# Altium project ESP32_Flag_Tracker.PrjPcb
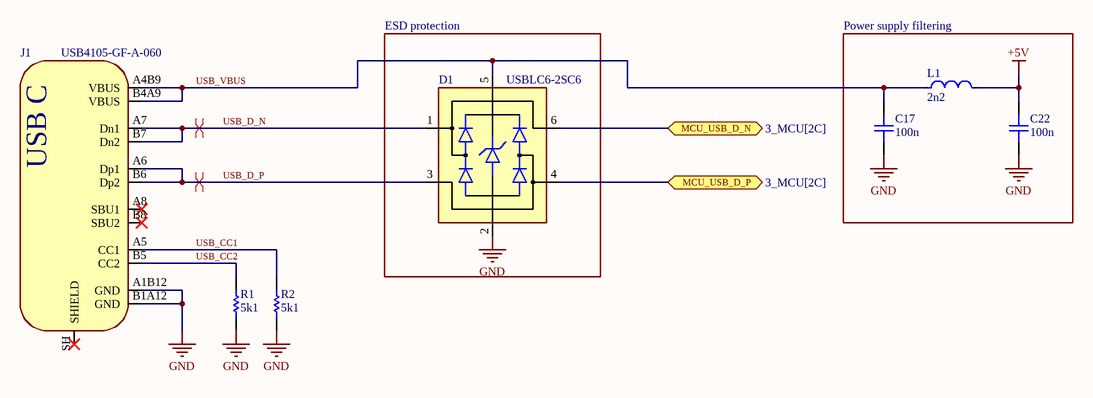
[diagram p0: 1_USB.SchDoc]
6 sheets, 53 parts. Net scope: flat (ports and power ports of the same name join across sheets).
Board file: PCB.PcbDoc
Sheets:
  0_Overview.SchDoc
  1_USB.SchDoc
  2_Power.SchDoc
  3_MCU.SchDoc
  4_Accelerometer.SchDoc
  5_RF.SchDoc

## Sheet 0_Overview.SchDoc
size A4; SheetNumber: 3; SheetTotal: 3

## Sheet 1_USB.SchDoc
size A4; SheetNumber: 2; SheetTotal: 6

### Parts
C17  100n  [CAP_0402]
C22  100n  [CAP_0402]
D1  USBLC6-2SC6  [SOT-23-6]
J1  USB4105-GF-A-060  [USB4105-GF-A-060]
L1  2n2  [FP-LQW15AN_80-MFG]
R1  5k1  [RESC1005X40X25ML10T10]
R2  5k1  [RESC1005X40X25ML10T10]

### Blocks framed on the sheet
ESD protection: D1
Power supply filtering: C17 C22 L1

### Ports
MCU_USB_D_N (bidir, see 3_MCU[2C]), MCU_USB_D_P (bidir, see 3_MCU[2C])

### Nets
+5V: C22.2 L1.2
GND: C17.1 C22.1 D1.2(GND) J1.A1B12(GND) J1.B1A12(GND) R1.2 R2.2
MCU_USB_D_N: D1.6(IO1) ; port MCU_USB_D_N
MCU_USB_D_P: D1.4(IO2) ; port MCU_USB_D_P
USB_CC1: J1.A5(CC1) R2.1
USB_CC2: J1.B5(CC2) R1.1
USB_D_N: D1.1(IO1) J1.A7(Dn1) J1.B7(Dn2)
USB_D_P: D1.3(IO2) J1.A6(Dp1) J1.B6(Dp2)
USB_VBUS: C17.2 D1.5(VBUS) J1.A4B9(VBUS) J1.B4A9(VBUS) L1.1

Not connected (* = marked no-connect by the designer): J1 A8(SBU1)* B8(SBU2)* SH(SHIELD)*

### Layout directives
differential pair: USB_D_N, USB_D_P

### Notes on the sheet
- (in symbol USB4105-GF-A-060) USB C

### Library data of the parts
C17 C22 = CAP_0402_16V: Capacitor SMD 0402 16V; Supplier 1: Mouser; Supplier Part Number 1: 187-CL05A104KP5NNND
D1 = USBLC6-2SC6: Low-Capacitance ESD Protection USB; Manufacturer: STMicroelectronics; Manufacturer Part Number: USBLC6-2SC6; Distributor Link: https://www.mouser.de/ProductDetail/STMicroelectronics/USBLC6-2SC6?qs=po45yt2pPpu%2FhNIlwQdTlg%3D%3D; Supplier 1: Mouser; Supplier Part Number 1: 511-USBLC6-2SC6
J1 = USB4105-GF-A-060: USB Connector Type C SMT 12 Pin; Manufacturer: GCT; Manufacturer Part Number: USB4105-GF-A-060
L1 = CMP-06042-014713-1: Wire Wound RF Inductor 2.2nH ±2% 2530mA 0.022Ω 0402 (1005)
R1 R2 = CMP-2002-03675-1: Part Number: RK73B1ETTP512J; Manufacturer: KOA Speer

## Sheet 2_Power.SchDoc
size A4; SheetNumber: 3; SheetTotal: 7
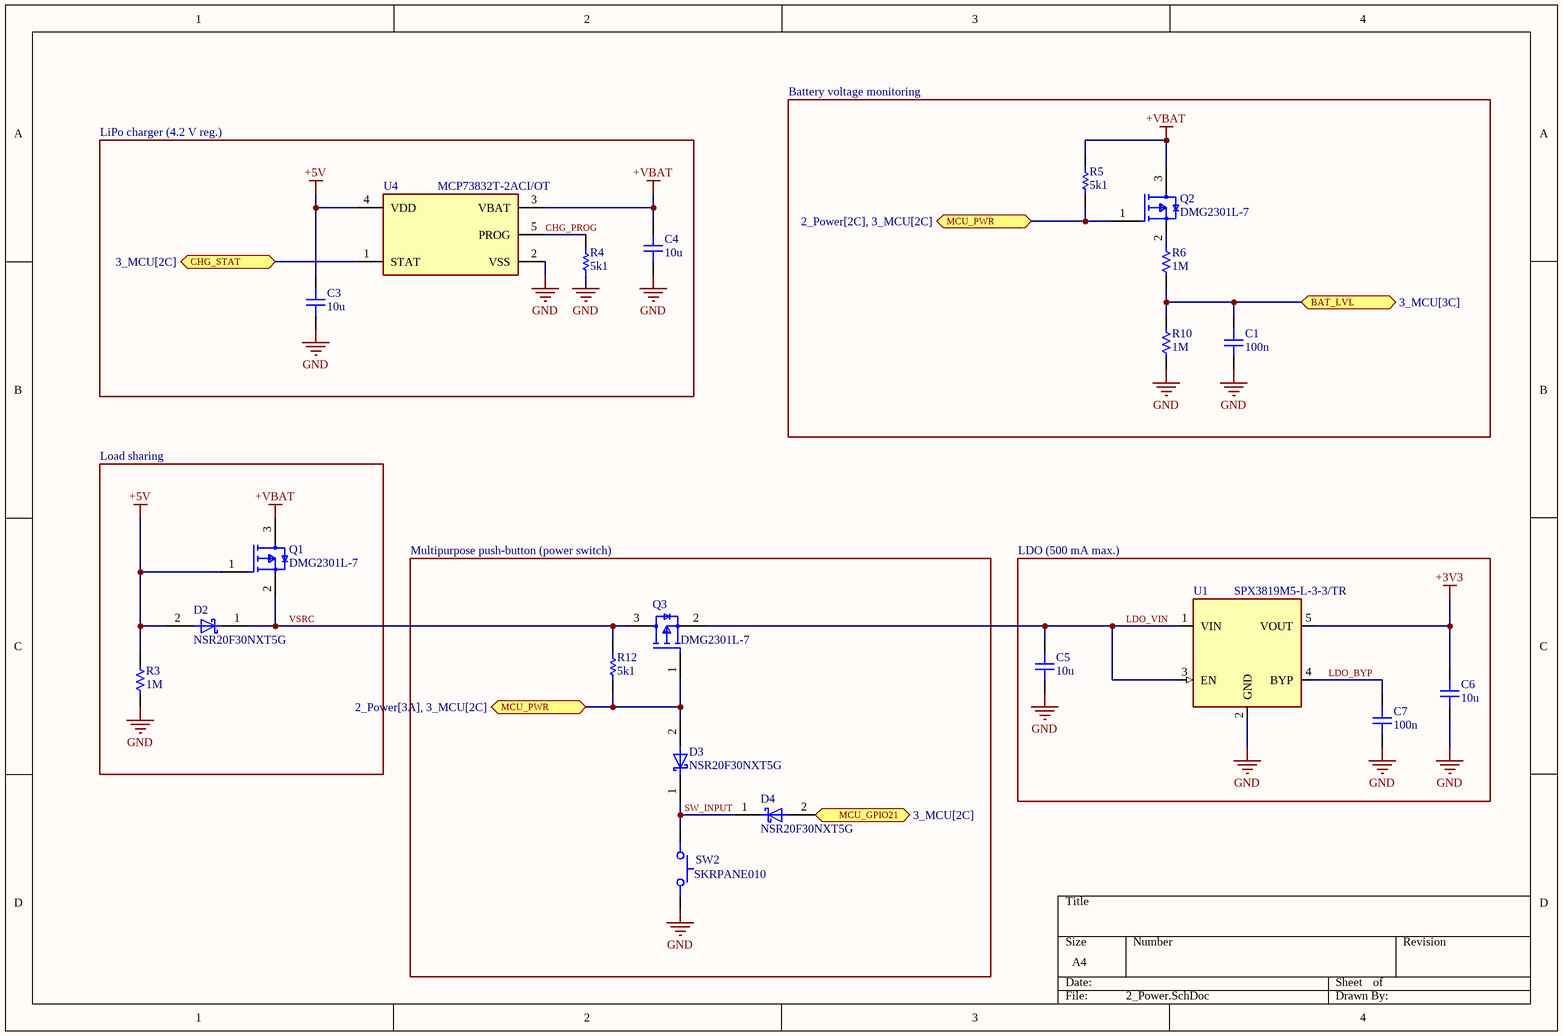
[diagram p1: 2_Power.SchDoc]

### Parts
C1  100n  [CAP_0402]
C3  10u  [CAP_0402]
C4  10u  [CAP_0402]
C5  10u  [CAP_0402]
C6  10u  [CAP_0402]
C7  100n  [CAP_0402]
D2  NSR20F30NXT5G  [ONSC-DSN-2-512AB-01_V]
D3  NSR20F30NXT5G  [ONSC-DSN-2-512AB-01_V]
D4  NSR20F30NXT5G  [ONSC-DSN-2-512AB-01_V]
Q1  DMG2301L-7  [FP-SOT23-MFG]
Q2  DMG2301L-7  [FP-SOT23-MFG]
Q3  DMG2301L-7  [FP-SOT23-MFG]
R3  1M  [RES_0402]
R4  5k1  [RESC1005X40X25ML10T10]
R5  5k1  [RESC1005X40X25ML10T10]
R6  1M  [RES_0402]
R10  1M  [RES_0402]
R12  5k1  [RESC1005X40X25ML10T10]
SW2  SKRPANE010  [SKRPANE010]
U1  SPX3819M5-L-3-3/TR  [SOT-23-5]
U4  MCP73832T-2ACI/OT  [FP-C04-091-OT-MFG]

### Blocks framed on the sheet
Battery voltage monitoring: C1 Q2 R5 R6 R10
LiPo charger (4.2 V reg.): C3 C4 R4 U4
Load sharing: D2 Q1 R3
Multipurpose push-button (power switch): D3 D4 Q3 R12 SW2
LDO (500 mA max.): C5-C7 U1

### Ports
BAT_LVL (bidir, see 3_MCU[3C]), CHG_STAT (bidir, see 3_MCU[2C]), MCU_GPIO21 (bidir, see 3_MCU[2C]), MCU_PWR (bidir, see 2_Power[2C], 3_MCU[2C]), MCU_PWR (bidir, see 2_Power[3A], 3_MCU[2C])

### Nets
+3V3: C6.2 U1.5(VOUT)
+5V: C3.2 D2.2(A) Q1.1(G) R3.2 U4.4(VDD)
+VBAT: C4.2 Q1.3(D) Q2.3(D) R5.2 U4.3(VBAT)
GND: C1.1 C3.1 C4.1 C5.1 C6.1 C7.1 R3.1 R4.1 R10.1 SW2.12 U1.2(GND) U4.2(VSS)
CHG_PROG: R4.2 U4.5(PROG)
LDO_BYP: C7.2 U1.4(BYP)
LDO_VIN: C5.2 Q3.2(S) U1.1(VIN) U1.3(EN)
MCU_ADC1_CH0: C1.2 R6.1 R10.2 ; port BAT_LVL
MCU_GPIO6: U4.1(STAT) ; port CHG_STAT
MCU_GPIO20: D3.2(A) Q2.1(G) Q3.1(G) R5.1 R12.1 ; port MCU_PWR
MCU_GPIO21: D4.2(A) ; port MCU_GPIO21
SW_INPUT: D3.1(K) D4.1(K) SW2.34
VSRC: D2.1(K) Q1.2(S) Q3.3(D) R12.2
NetQ2_2: Q2.2(S) R6.2

### Library data of the parts
C1 C7 = CAP_0402_16V: Capacitor SMD 0402 16V; Supplier 1: Mouser; Supplier Part Number 1: 187-CL05A104KP5NNND
C3-C6 = CAP_0402_10V: Capacitor SMD 0402 10V; Supplier 1: Arrow Electronics; Supplier Part Number 1: GRM155R61A106ME11D
D2-D4 = ONSC_D_SCHOTTKY_0603-4: Rectifier Diode, Schottky, 1 Phase, 1 Element, 2A, 30V V(RRM), Silicon; Forward Voltage: 420mV; Qualification Status: Not Qualified; Number of Elements: 1; Application(s): EFFICIENCY; Non-rep Pk Forward Current-Max: 28A; Max Power Dissipation: 1.56W; Case Connection: ANODE; Reach SVHC Compliant: Yes; Diode Element Material: SILICON; Pins: 2; RoHS Compliant: Yes; Rep Pk Reverse Voltage-Max: 30V; Technology: SCHOTTKY; Terminal Position: BOTTOM; Surface Mount: Yes; Max Operating Temperature: 150°C; Package Shape: Rectangular; Diode Type: RECTIFIER; Number of Phases: 1; Terminal Form: No Lead; Max Output current: 2A; Package Style: CHIP CARRIERMeter
Q1-Q3 = CMP-12801-000065-1: MOSFET P-CH 20V 3A SOT23; Manufacturer: Diodes Inc.; Number Of Channels: 1; Turn On Delay Time: 5ns; Drain To Source Resistance: 120mΩ; Max Junction Temp: +150°C; Gate To Source Voltage: 8V; Power Dissipation: 1.5W; Rthja Max: 83°C/W; Max Forward Diode Voltage: -1.2V; Standoff Height: 0.013mm; Threshold Vgs Min: -0.4V; Input Capacitace At Vds: 476pF @ -10V; Depletion Mode: False; Gate Charge At Vgs: 5.5nC @ -4.5V; Pulse Drain Current: -10A; Drain To Source Voltage: -20V; Continuous Drain Current: -3A; Turn Off Delay Time: 30ns; Lead Free: Yes; Package: SOT23; ComponentLink2Description: Datasheet; Device Class L3: MOSFETs; Device Class L1: Discrete Semiconductors; Manufacturer Part Number: DMG2301L-7; Automotive: No; Height: 1.1mm; Category: Trans; Temperature Range High: +150°C; Digikey Description: MOSFET P-CH 20V 3A SOT23; RoHS: TRUE; Number Of P Channels: 1; Footprint Url: https://www.diodes.com/assets/Package-Files/SOT23.pdf; Octopart: https://octopart.com/dmg2301l-7-diodes+inc.-67250456; ComponentLink2URL: https://www.diodes.com/assets/Datasheets/DMG2301L.pdf; Mouser Description: Single P-Channel 20 V 1.5 W 5.5 nC Silicon Surface Mount Mosfet - SOT-23; Drain To Source Breakdown Voltage: -20V; Threshold Vgs Max: -1.2V; Device Class L2: Transistors; Temperature: -55°C to +150°C; Temperature Range Low: -55°C
R3 R6 R10 = RES_0402: Resistor SMD 0402; Manufacturer: *; Manufacturer Part Number: *; Distributor Link: *; Supplier 1: Mouser; Supplier Part Number 1: 71-CRCW04021M00FKEDC
R4 R5 R12 = CMP-2002-03675-1: as R1 on sheet 1_USB
SW2 = SKRPANE010: Tactile Switch SMD SPST; Manufacturer: Alps Alpine; Manufacturer Part Number: SKRPANE010; Supplier 1: Mouser; Supplier Part Number 1: 688-SKRPANE010
U1 = SPX3819M5-L-3-3/TR: 500mA +3.3V Low-Noise LDO Voltage Regulator; Manufacturer: MaxLinear; Manufacturer Part Number: SPX3819M5-L-3-3/TR
U4 = CMP-0133-00138-2: IC LI-ION/LI-POLY CTRLR SOT23-5; Output Current: 10mA; Output Voltage: 4.2V; Max Output Current: 500mA; Max Power Dissipation: 1.54W; Min Output Voltage: 4.168V; Number of Channels: 1; Max Supply Voltage: 6V; Min Supply Voltage: 3.75V; Max Output Voltage: 4.5V; Case/Package: SOT-23; Lead Free: Lead Free; Termination: SMD/SMT; Min Operating Temperature: -40°C; Max Operating Temperature: 85°C; Height: 1.3mm; Length: 3.1mm; Mount: Surface Mount; Package Quantity: 3000; Number of Pins: 5; Packaging: Tape and Reel; REACH SVHC: No SVHC; Contact Plating: Tin; Width: 1.8mm; Number of Cells: 1; Number of Outputs: 1; Power Dissipation: 1.54W; Max Charge Current: 500mA; Max Input Voltage: 6V; Radiation Hardening: No

## Sheet 3_MCU.SchDoc
size A4; SheetNumber: 4; SheetTotal: 6
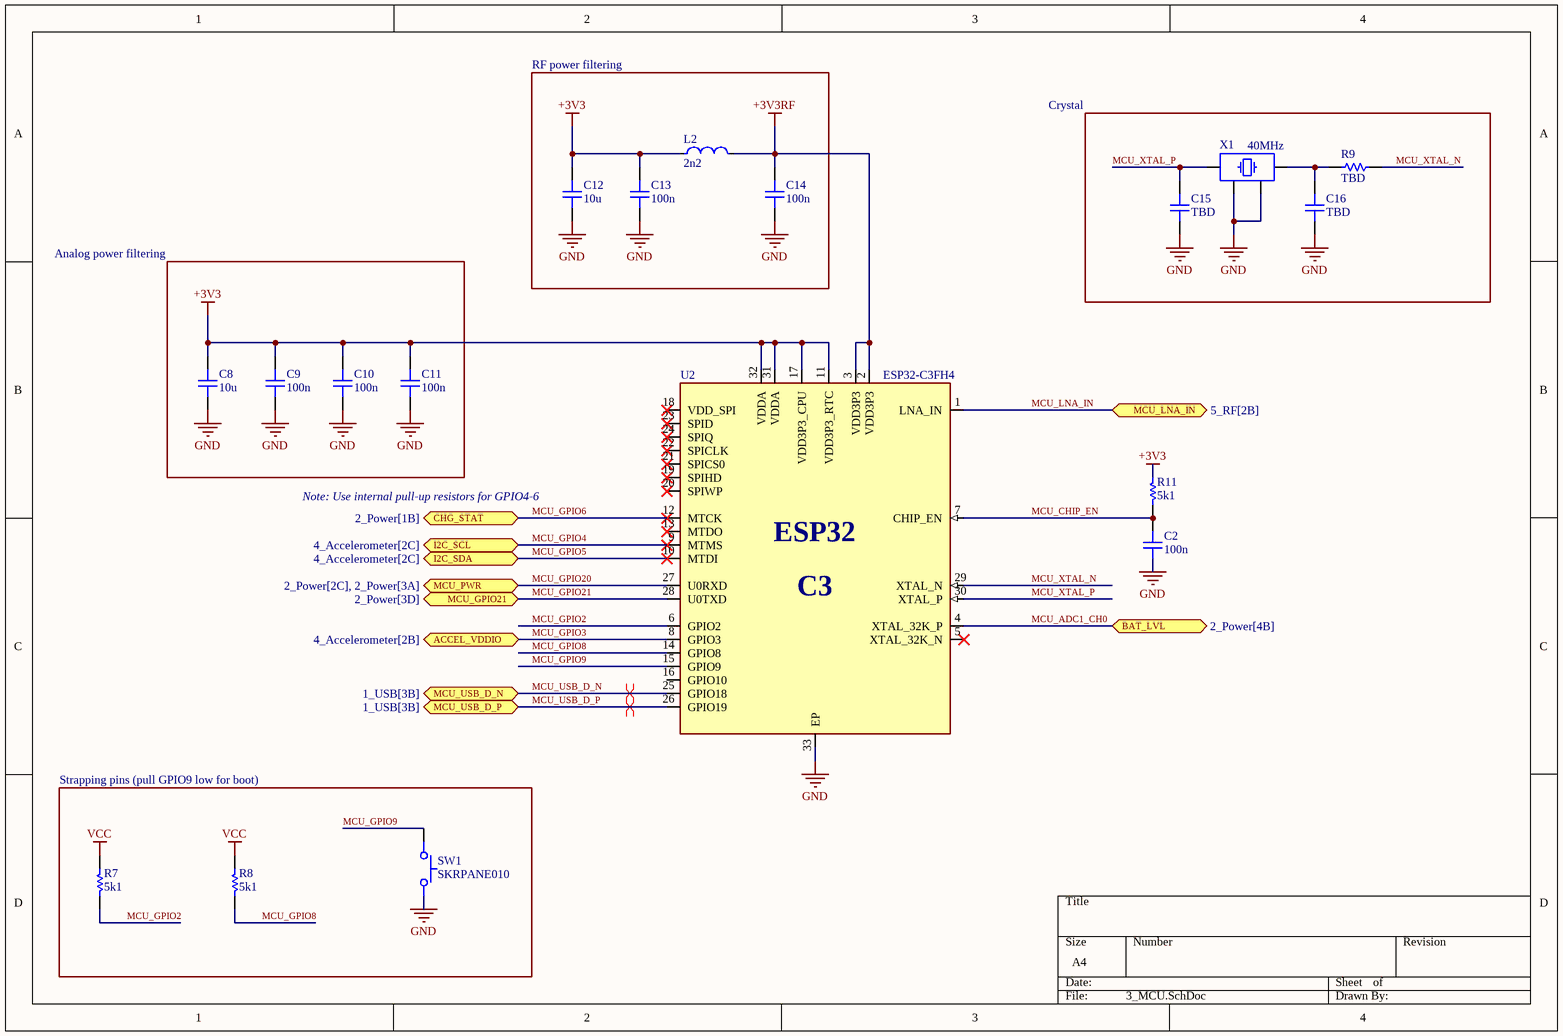
[diagram p2: 3_MCU.SchDoc]

### Parts
C2  100n  [CAP_0402]
C8  10u  [CAP_0402]
C9  100n  [CAP_0402]
C10  100n  [CAP_0402]
C11  100n  [CAP_0402]
C12  10u  [CAP_0402]
C13  100n  [CAP_0402]
C14  100n  [CAP_0402]
C15  TBD  [CAP_0402]
C16  TBD  [CAP_0402]
L2  2n2  [FP-LQW15AN_80-MFG]
R7  5k1  [RESC1005X40X25ML10T10]
R8  5k1  [RESC1005X40X25ML10T10]
R9  TBD  [RES_0402]
R11  5k1  [RESC1005X40X25ML10T10]
SW1  SKRPANE010  [SKRPANE010]
U2  ESP32-C3FH4  [QFN32-5x5]
X1  40MHz  [XTAL_2520]

### Blocks framed on the sheet
RF power filtering: C12-C14 L2
Crystal: C15 C16 R9 X1
Analog power filtering: C8-C11
Strapping pins (pull GPIO9 low for boot): R7 R8 SW1

### Ports
ACCEL_VDDIO (bidir, see 4_Accelerometer[2B]), BAT_LVL (bidir, see 2_Power[4B]), CHG_STAT (bidir, see 2_Power[1B]), I2C_SCL (bidir, see 4_Accelerometer[2C]), I2C_SDA (bidir, see 4_Accelerometer[2C]), MCU_GPIO21 (bidir, see 2_Power[3D]), MCU_LNA_IN (bidir, see 5_RF[2B]), MCU_PWR (bidir, see 2_Power[2C], 2_Power[3A]), MCU_USB_D_N (bidir, see 1_USB[3B]), MCU_USB_D_P (bidir, see 1_USB[3B])

### Nets
+3V3: C8.2 C9.2 C10.2 C11.2 C12.2 C13.2 L2.1 R11.1 U2.11(VDD3P3_RTC) U2.17(VDD3P3_CPU) U2.31(VDDA) U2.32(VDDA)
+3V3RF: C14.2 L2.2 U2.2(VDD3P3) U2.3(VDD3P3)
GND: C2.2 C8.1 C9.1 C10.1 C11.1 C12.1 C13.1 C14.1 C15.1 C16.1 SW1.12 U2.33(EP) X1.2 X1.4
MCU_GPIO3: U2.8(GPIO3) ; port ACCEL_VDDIO
VCC: R7.2 R8.2
MCU_ADC1_CH0: U2.4(XTAL_32K_P) ; port BAT_LVL
MCU_CHIP_EN: C2.1 R11.2 U2.7(CHIP_EN)
MCU_GPIO2: R7.1 U2.6(GPIO2)
MCU_GPIO4: U2.9(MTMS) ; port I2C_SCL
MCU_GPIO5: U2.10(MTDI) ; port I2C_SDA
MCU_GPIO6: U2.12(MTCK) ; port CHG_STAT
MCU_GPIO8: R8.1 U2.14(GPIO8)
MCU_GPIO9: SW1.34 U2.15(GPIO9)
MCU_GPIO20: U2.27(U0RXD) ; port MCU_PWR
MCU_GPIO21: U2.28(U0TXD) ; port MCU_GPIO21
MCU_LNA_IN: U2.1(LNA_IN) ; port MCU_LNA_IN
MCU_USB_D_N: U2.25(GPIO18) ; port MCU_USB_D_N
MCU_USB_D_P: U2.26(GPIO19) ; port MCU_USB_D_P
MCU_XTAL_N: R9.2 U2.29(XTAL_N)
MCU_XTAL_P: C15.2 U2.30(XTAL_P) X1.1
NetC16_2: C16.2 R9.1 X1.3

Not connected (* = marked no-connect by the designer): U2 5(XTAL_32K_N)* 13(MTDO)* 16(GPIO10) 18(VDD_SPI)* 19(SPIHD)* 20(SPIWP)* 21(SPICS0)* 22(SPICLK)* 23(SPID)* 24(SPIQ)*

### Layout directives
differential pair: MCU_USB_D_N, MCU_USB_D_P

### Notes on the sheet
- Note: Use internal pull-up resistors for GPIO4-6
- (in symbol ESP32-C3) ESP32; C3

### Library data of the parts
C2 C9-C11 C13 C14 = CAP_0402_16V: Capacitor SMD 0402 16V; Supplier 1: Mouser; Supplier Part Number 1: 187-CL05A104KP5NNND
C8 C12 C15 C16 = CAP_0402_10V: Capacitor SMD 0402 10V
  C8 C12: Supplier 1: Arrow Electronics; Supplier Part Number 1: GRM155R61A106ME11D
L2 = CMP-06042-014713-1: as L1 on sheet 1_USB
R7 R8 R11 = CMP-2002-03675-1: as R1 on sheet 1_USB
R9 = RES_0402: Resistor SMD 0402; Manufacturer: *; Manufacturer Part Number: *; Distributor Link: *
SW1 = SKRPANE010: as SW2 on sheet 2_Power; Manufacturer Part Number: SKRPANE010; Supplier 1: Mouser; Supplier Part Number 1: 688-SKRPANE010
U2 = ESP32-C3: Ultra­Low­Power SoC with RISC­V Single­Core CPU Supporting IEEE 802.11b/g/n (2.4 GHz Wi­Fi) and Bluetooth® 5 (LE); Manufacturer: Espressif; Manufacturer Part Number: ESP32-C3; LCSC: C2838500; Supplier 1: Digi-Key; Supplier Part Number 1: 1904-ESP32-C3FH4CT-ND
X1 = XTAL_2520: Crystal SMD 2520; Distributor Link: *; Supplier 1: Farnell; Supplier Part Number 1: 4072596

## Sheet 4_Accelerometer.SchDoc
size A4; SheetNumber: 5; SheetTotal: 6
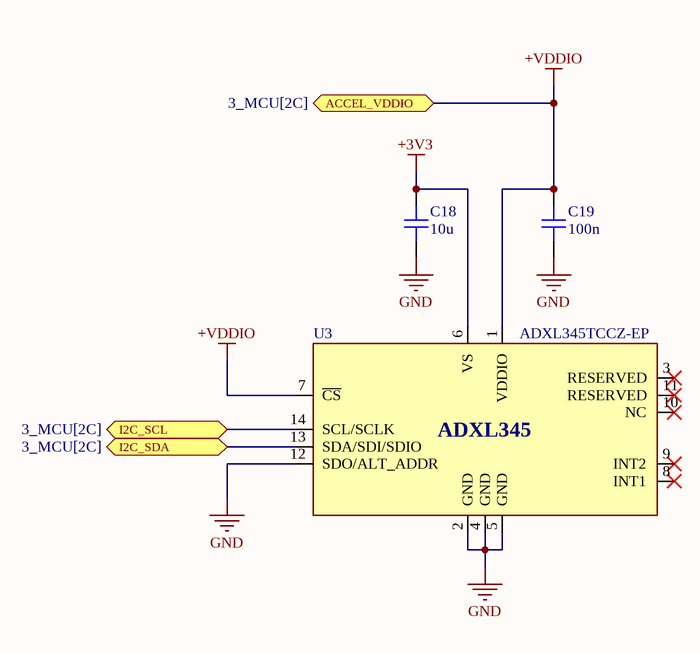
[diagram p3: 4_Accelerometer.SchDoc]

### Parts
C18  10u  [CAP_0402]
C19  100n  [CAP_0402]
U3  ADXL345TCCZ-EP  [LGA_CC-14-1_ADI]

### Ports
ACCEL_VDDIO (bidir, see 3_MCU[2C]), I2C_SCL (bidir, see 3_MCU[2C]), I2C_SDA (bidir, see 3_MCU[2C])

### Nets
+3V3: C18.2 U3.6(VS)
+VDDIO: C19.2 U3.1(VDDIO) U3.7(~{CS}) ; port ACCEL_VDDIO  [project net MCU_GPIO3]
GND: C18.1 C19.1 U3.2(GND) U3.4(GND) U3.5(GND) U3.12(SDO/ALT_ADDR)
MCU_GPIO4: U3.14(SCL/SCLK) ; port I2C_SCL
MCU_GPIO5: U3.13(SDA/SDI/SDIO) ; port I2C_SDA

Not connected (* = marked no-connect by the designer): U3 3(RESERVED)* 8(INT1)* 9(INT2)* 10(NC)* 11(RESERVED)*

### Notes on the sheet
- (in symbol ADXL345TCCZ-EP) ADXL345

### Library data of the parts
C18 = CAP_0402_10V: Capacitor SMD 0402 10V; Supplier 1: Arrow Electronics; Supplier Part Number 1: GRM155R61A106ME11D
C19 = CAP_0402_16V: Capacitor SMD 0402 16V; Supplier 1: Mouser; Supplier Part Number 1: 187-CL05A104KP5NNND
U3 = ADXL345TCCZ-EP: 3-Axis, ±2 g/±4 g/±8 g/±16 g Digital Accelerometer Extended Performance SPI/I2C; Manufacturer: Analog Devices; Manufacturer Part Number: ADXL345TCCZ-EP; Supplier 1: Mouser; Supplier Part Number 1: 584-ADXL345TCCZ-EP

## Sheet 5_RF.SchDoc
size A4; SheetNumber: 5; SheetTotal: 5
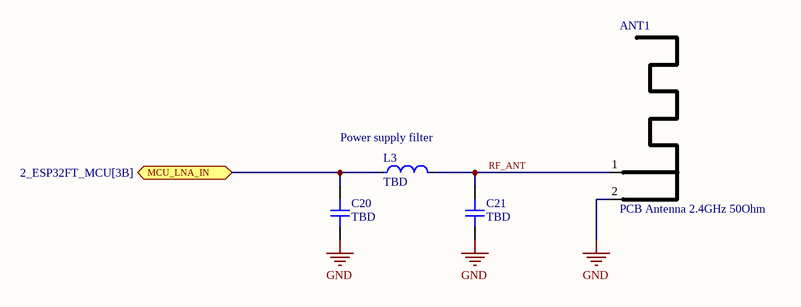
[diagram p4: 5_RF.SchDoc]

### Parts
ANT1  PCB Antenna 2.4GHz 50Ohm  [ANT_IFA_USB_2_4GHZ_50R]  (no BOM)
C20  TBD  [CAP_0402]
C21  TBD  [CAP_0402]
L3  TBD  [FP-LQW15AN_80-MFG]

### Ports
MCU_LNA_IN (bidir, see 2_ESP32FT_MCU[3B])

### Nets
GND: ANT1.2(GND) C20.1 C21.1
MCU_LNA_IN: C20.2 L3.1 ; port MCU_LNA_IN
RF_ANT: ANT1.1(RF) C21.2 L3.2

### Notes on the sheet
- (near L3) Power supply filter

### Library data of the parts
ANT1 = ANT_IFA_USB_2_4GHZ_50R: Inverted F 2.4GHz ISM PCB Antenna 50 Ohm; ComponentLink1Description: Datasheet; ComponentLink1URL: https://www.ti.com/lit/an/swra117d/swra117d.pdf
C20 C21 = CAP_0402_16V: Capacitor SMD 0402 16V; Supplier 1: Mouser; Supplier Part Number 1: 187-CL05A104KP5NNND
L3 = CMP-06042-014713-1: as L1 on sheet 1_USB

## Nets that join several sheets
+3V3: 2_Power (C6.2 U1.5), 3_MCU (12 pins), 4_Accelerometer (C18.2 U3.6)
+5V: 1_USB (C22.2 L1.2), 2_Power (5 pins)
GND: 1_USB (7 pins), 2_Power (12 pins), 3_MCU (14 pins), 4_Accelerometer (6 pins), 5_RF (ANT1.2 C20.1 C21.1)
MCU_GPIO3: 3_MCU (U2.8), 4_Accelerometer (C19.2 U3.1 U3.7)
MCU_ADC1_CH0: 2_Power (C1.2 R6.1 R10.2), 3_MCU (U2.4)
MCU_GPIO4: 3_MCU (U2.9), 4_Accelerometer (U3.14)
MCU_GPIO5: 3_MCU (U2.10), 4_Accelerometer (U3.13)
MCU_GPIO6: 2_Power (U4.1), 3_MCU (U2.12)
MCU_GPIO20: 2_Power (5 pins), 3_MCU (U2.27)
MCU_GPIO21: 2_Power (D4.2), 3_MCU (U2.28)
MCU_LNA_IN: 3_MCU (U2.1), 5_RF (C20.2 L3.1)
MCU_USB_D_N: 1_USB (D1.6), 3_MCU (U2.25)
MCU_USB_D_P: 1_USB (D1.4), 3_MCU (U2.26)